# Altium schematic sheet LCD.SchDoc
size A4
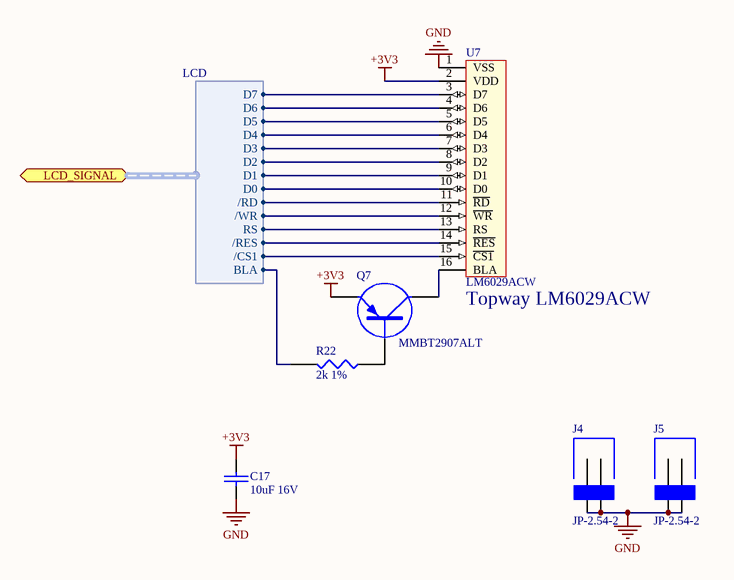
[diagram p0: LCD.SchDoc]

## Parts
C17  10uF 16V  [CAPC3216N]
J4  JP-2.54-2  [JP2-P2.54]
J5  JP-2.54-2  [JP2-P2.54]
Q7  MMBT2907ALT  [SOT23-3M]
R22  2k 1%  [RESC2012N]
U7  LM6029ACW  [LM6029A]

## Ports
LCD_SIGNAL (harness LCD)

## Harnesses
LCD: D7, D6, D5, D4, D3, D2, D1, D0, /RD, /WR, RS, /RES, /CS1, BLA

## Nets
+3V3: C17.1 Q7.2(E) U7.2(VDD)
GND: C17.2 J4.1 J4.2 J5.1 J5.2 U7.1(VSS)
NetQ7_1: Q7.1(B) R22.1
NetQ7_3: Q7.3(C) U7.16(BLA)
NetR22_2: R22.2 ; port LCD_SIGNAL.BLA
NetU7_3: U7.3(D7) ; port LCD_SIGNAL.D7
NetU7_4: U7.4(D6) ; port LCD_SIGNAL.D6
NetU7_5: U7.5(D5) ; port LCD_SIGNAL.D5
NetU7_6: U7.6(D4) ; port LCD_SIGNAL.D4
NetU7_7: U7.7(D3) ; port LCD_SIGNAL.D3
NetU7_8: U7.8(D2) ; port LCD_SIGNAL.D2
NetU7_9: U7.9(D1) ; port LCD_SIGNAL.D1
NetU7_10: U7.10(D0) ; port LCD_SIGNAL.D0
NetU7_11: U7.11(~{RD}) ; port LCD_SIGNAL./RD
NetU7_12: U7.12(~{WR}) ; port LCD_SIGNAL./WR
NetU7_13: U7.13(RS) ; port LCD_SIGNAL.RS
NetU7_14: U7.14(~{RES}) ; port LCD_SIGNAL./RES
NetU7_15: U7.15(~{CS1}) ; port LCD_SIGNAL./CS1

## Notes on the sheet
- (near U7) Topway LM6029ACW

## Library data of the parts
C17 = CAP: Capacitor
J4 J5 = JP2-2.54
Q7 = MMBT3906: PNP transitor; Price: 0.25
R22 = RES1: Price: 0.0025
U7 = LM6029A: Topway LCD module 3.3V; Price: 35